# Altium schematic sheet Block-Diagram.SchDoc
size A4; SheetNumber: 1; SheetTotal: 5
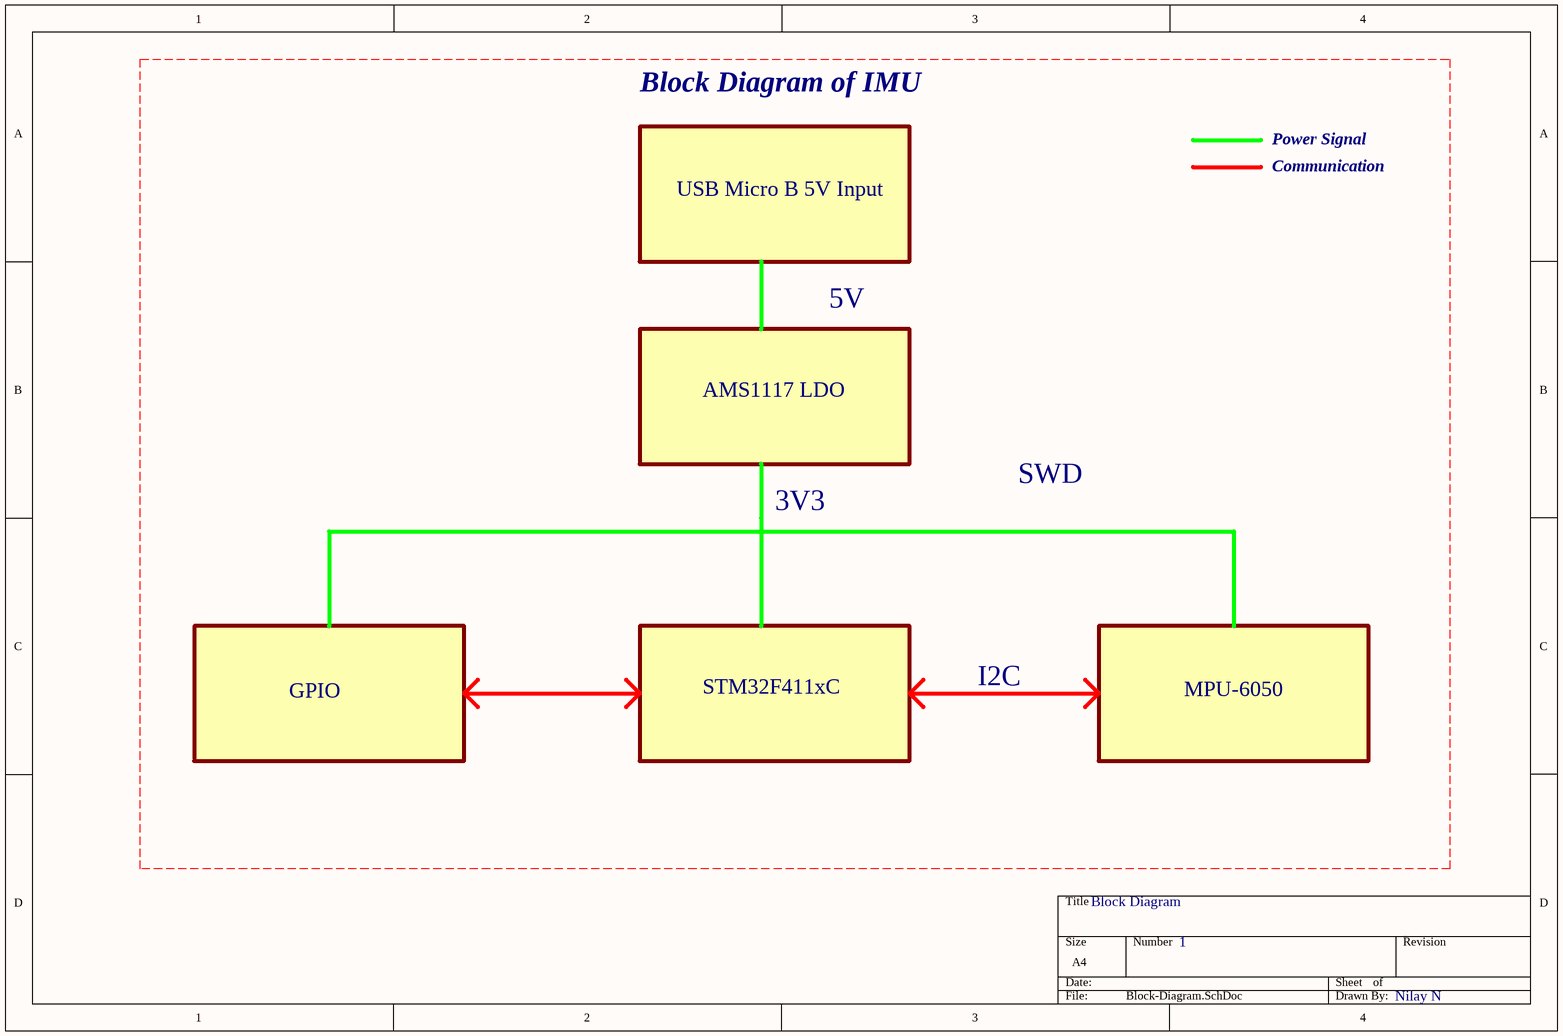
[diagram p0: Block-Diagram.SchDoc]

## Notes on the sheet
- Block Diagram of IMU
- Power Signal
- Communication
- USB Micro B 5V Input
- 5V
- AMS1117 LDO
- 3V3
- SWD
- GPIO
- STM32F411xC
- I2C
- MPU-6050
- Block Diagram
- 1
- Nilay N